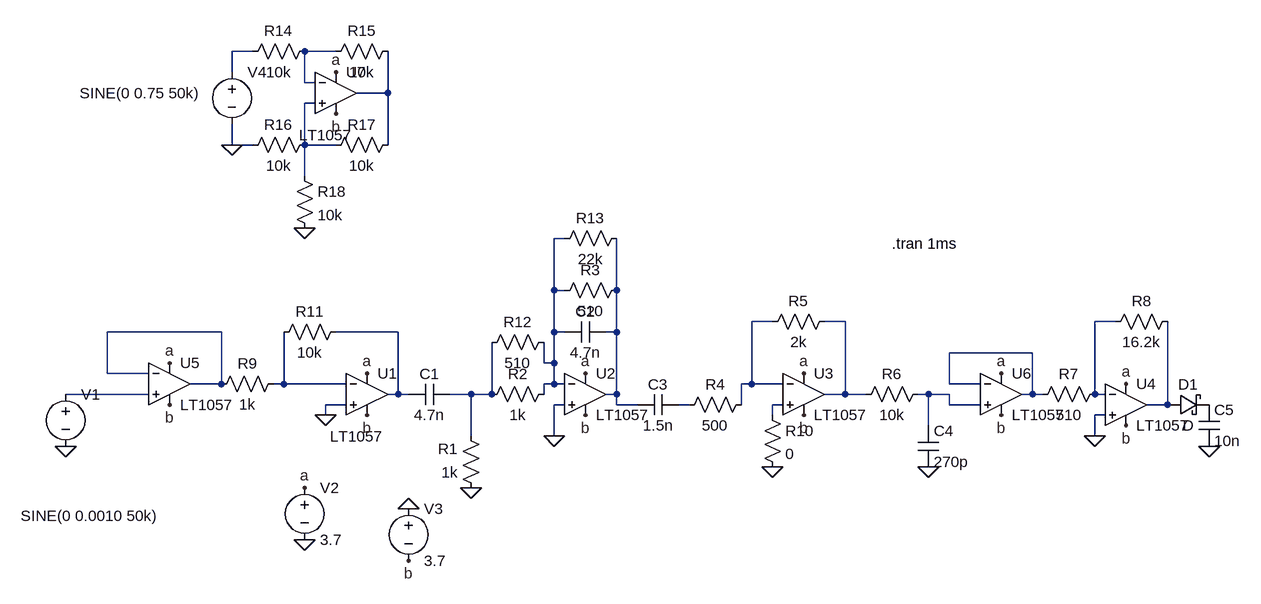
[diagram p0: schematic Filtrado actual.asc]
Filtrado actual.asc, the LTspice schematic file:
Version 4
SHEET 1 1228 680
WIRE -304 -208 -336 -208
WIRE -176 -208 -224 -208
WIRE -336 -176 -336 -208
WIRE -224 -160 -224 -208
WIRE -208 -160 -224 -160
WIRE -96 -144 -96 -208
WIRE -96 -144 -144 -144
WIRE -208 -128 -224 -128
WIRE -336 -64 -336 -96
WIRE -304 -64 -336 -64
WIRE -224 -64 -224 -128
WIRE -176 -64 -224 -64
WIRE -96 -64 -96 -144
WIRE -224 -16 -224 -64
WIRE 176 80 160 80
WIRE 160 160 160 80
WIRE 176 160 160 160
WIRE 256 160 256 80
WIRE 496 208 464 208
WIRE 608 208 576 208
WIRE 1024 208 992 208
WIRE -352 224 -528 224
WIRE -80 224 -176 224
WIRE 160 224 160 160
WIRE 176 224 160 224
WIRE 256 224 256 160
WIRE 256 224 240 224
WIRE 896 256 768 256
WIRE 144 272 144 240
WIRE 160 272 160 224
WIRE 160 272 144 272
WIRE -528 288 -528 224
WIRE -464 288 -528 288
WIRE -352 304 -352 224
WIRE -352 304 -400 304
WIRE -256 304 -256 224
WIRE -256 304 -272 304
WIRE -160 304 -256 304
WIRE 160 304 160 272
WIRE 160 304 144 304
WIRE 176 304 160 304
WIRE 464 304 464 208
WIRE 464 304 448 304
WIRE 512 304 464 304
WIRE 768 304 768 256
WIRE 816 304 768 304
WIRE -464 320 -592 320
WIRE -80 320 -80 224
WIRE -80 320 -96 320
WIRE -64 320 -80 320
WIRE 32 320 0 320
WIRE 64 320 64 240
WIRE 64 320 32 320
WIRE 144 320 144 304
WIRE 256 320 256 224
WIRE 256 320 240 320
WIRE 608 320 608 208
WIRE 608 320 576 320
WIRE 640 320 608 320
WIRE 736 320 720 320
WIRE 768 320 736 320
WIRE 896 320 896 256
WIRE 896 320 880 320
WIRE 912 320 896 320
WIRE 992 320 992 208
WIRE 1008 320 992 320
WIRE -160 336 -192 336
WIRE 176 336 160 336
WIRE 256 336 256 320
WIRE 288 336 256 336
WIRE 368 336 352 336
WIRE 448 336 448 304
WIRE 512 336 496 336
WIRE 768 336 768 320
WIRE 816 336 768 336
WIRE 1104 336 1104 208
WIRE 1104 336 1072 336
WIRE -192 352 -192 336
WIRE 496 352 496 336
WIRE 1008 352 992 352
WIRE 736 368 736 320
WIRE 32 384 32 320
WIRE 160 384 160 336
WIRE 992 384 992 352
FLAG 32 464 0
FLAG 992 384 0
FLAG 736 432 0
FLAG 160 384 0
FLAG -224 544 0
FLAG -64 496 0
FLAG -224 464 a
FLAG 208 288 a
FLAG -128 288 a
FLAG 544 288 a
FLAG 1040 304 a
FLAG -64 576 b
FLAG -128 352 b
FLAG 208 352 b
FLAG 544 352 b
FLAG 1040 368 b
FLAG -192 352 0
FLAG -432 272 a
FLAG -432 336 b
FLAG 848 288 a
FLAG 848 352 b
FLAG 496 432 0
FLAG 1168 400 0
FLAG -592 400 0
FLAG -224 64 0
FLAG -336 -64 0
FLAG -176 -176 a
FLAG -176 -112 b
SYMBOL Res 48 480 R180
WINDOW 0 36 76 Left 2
WINDOW 3 36 40 Left 2
SYMATTR InstName R1
SYMATTR Value 1k
SYMBOL Res 48 336 R270
WINDOW 0 32 56 VTop 2
WINDOW 3 0 56 VBottom 2
SYMATTR InstName R2
SYMATTR Value 1k
SYMBOL Res 160 176 R270
WINDOW 0 32 56 VTop 2
WINDOW 3 0 56 VBottom 2
SYMATTR InstName R3
SYMATTR Value 510
SYMBOL Res 352 352 R270
WINDOW 0 32 56 VTop 2
WINDOW 3 0 56 VBottom 2
SYMATTR InstName R4
SYMATTR Value 500
SYMBOL Res 480 224 R270
WINDOW 0 32 56 VTop 2
WINDOW 3 0 56 VBottom 2
SYMATTR InstName R5
SYMATTR Value 2k
SYMBOL Res 624 336 R270
WINDOW 0 32 56 VTop 2
WINDOW 3 0 56 VBottom 2
SYMATTR InstName R6
SYMATTR Value 10k
SYMBOL Res 896 336 R270
WINDOW 0 32 56 VTop 2
WINDOW 3 0 56 VBottom 2
SYMATTR InstName R7
SYMATTR Value 510
SYMBOL Res 1008 224 R270
WINDOW 0 32 56 VTop 2
WINDOW 3 0 56 VBottom 2
SYMATTR InstName R8
SYMATTR Value 16.2k
SYMBOL Cap -64 336 R270
WINDOW 0 32 32 VTop 2
WINDOW 3 0 32 VBottom 2
SYMATTR InstName C1
SYMATTR Value 4.7n
SYMBOL Cap 176 240 R270
WINDOW 0 32 32 VTop 2
WINDOW 3 0 32 VBottom 2
SYMATTR InstName C2
SYMATTR Value 4.7n
SYMBOL Cap 288 352 R270
WINDOW 0 32 32 VTop 2
WINDOW 3 0 32 VBottom 2
SYMATTR InstName C3
SYMATTR Value 1.5n
SYMBOL Cap 720 368 R0
SYMATTR InstName C4
SYMATTR Value 270p
SYMBOL Voltage -592 304 R0
WINDOW 3 -69 203 Left 2
SYMATTR Value SINE(0 0.0010 50k)
SYMATTR InstName V1
SYMBOL Voltage -224 448 R0
SYMATTR InstName V2
SYMATTR Value 3.7
SYMBOL Voltage -64 480 R0
SYMATTR InstName V3
SYMATTR Value 3.7
SYMBOL Res -256 288 R90
WINDOW 0 0 56 VBottom 2
WINDOW 3 32 56 VTop 2
SYMATTR InstName R9
SYMATTR Value 1k
SYMBOL OpAmps/LT1057 -128 256 R0
WINDOW 3 -57 129 Left 2
SYMATTR InstName U1
SYMBOL OpAmps/LT1057 208 256 R0
SYMATTR InstName U2
SYMBOL OpAmps/LT1057 544 256 R0
SYMATTR InstName U3
SYMBOL OpAmps/LT1057 1040 272 R0
SYMATTR InstName U4
SYMBOL OpAmps/LT1057 -432 240 R0
SYMATTR InstName U5
SYMBOL OpAmps/LT1057 848 256 R0
SYMATTR InstName U6
SYMBOL Res 480 336 R0
SYMATTR InstName R10
SYMATTR Value 0
SYMBOL schottky 1104 352 R270
WINDOW 0 32 32 VTop 2
WINDOW 3 0 32 VBottom 2
SYMATTR InstName D1
SYMBOL Cap 1152 336 R0
SYMATTR InstName C5
SYMATTR Value 10n
SYMBOL Res -160 208 R90
WINDOW 0 0 56 VBottom 2
WINDOW 3 32 56 VTop 2
SYMATTR InstName R11
SYMATTR Value 10k
SYMBOL Res 160 224 R90
WINDOW 0 0 56 VBottom 2
WINDOW 3 32 56 VTop 2
SYMATTR InstName R12
SYMATTR Value 510
SYMBOL Res 272 64 R90
WINDOW 0 0 56 VBottom 2
WINDOW 3 32 56 VTop 2
SYMATTR InstName R13
SYMATTR Value 22k
SYMBOL Res -208 -224 R90
WINDOW 0 0 56 VBottom 2
WINDOW 3 32 56 VTop 2
SYMATTR InstName R14
SYMATTR Value 10k
SYMBOL Res -80 -224 R90
WINDOW 0 0 56 VBottom 2
WINDOW 3 32 56 VTop 2
SYMATTR InstName R15
SYMATTR Value 10k
SYMBOL Res -208 -80 R90
WINDOW 0 0 56 VBottom 2
WINDOW 3 32 56 VTop 2
SYMATTR InstName R16
SYMATTR Value 10k
SYMBOL Res -80 -80 R90
WINDOW 0 0 56 VBottom 2
WINDOW 3 32 56 VTop 2
SYMATTR InstName R17
SYMATTR Value 10k
SYMBOL Res -240 -32 R0
SYMATTR InstName R18
SYMATTR Value 10k
SYMBOL Voltage -336 -192 R0
WINDOW 3 -234 48 Left 2
SYMATTR Value SINE(0 0.75 50k)
SYMATTR InstName V4
SYMBOL OpAmps/LT1057 -176 -208 R0
WINDOW 3 -57 129 Left 2
SYMATTR InstName U7
TEXT 680 88 Left 2 !.tran 1ms

The netlist it stands for:
* Filtrado actual.asc
R1 0 N015 1k
R2 N015 N005 1k
R3 N005 N006 510
R4 N017 N007 500
R5 N007 N008 2k
R6 N008 N016 10k
R7 N012 N009 510
R8 N009 N019 16.2k
C1 N011 N015 4.7n
C2 N005 N006 4.7n
C3 N006 N017 1.5n
C4 N016 0 270p
V1 N014 0 SINE(0 0.0010 50k)
V2 a 0 3.7
V3 0 b 3.7
R9 N013 N010 1k
XU1 0 N013 a b N011 LT1057  ; pins In+ In- V+ V- OUT
XU2 0 N005 a b N006 LT1057  ; pins In+ In- V+ V- OUT
XU3 N018 N007 a b N008 LT1057  ; pins In+ In- V+ V- OUT
XU4 0 N009 a b N019 LT1057  ; pins In+ In- V+ V- OUT
XU5 N014 N010 a b N010 LT1057  ; pins In+ In- V+ V- OUT
XU6 N016 N012 a b N012 LT1057  ; pins In+ In- V+ V- OUT
R10 N018 0 0
D1 N019 P001 D
C5 P001 0 10n
R11 N011 N013 10k
R12 N005 N015 510
R13 N006 N005 22k
R14 N002 N001 10k
R15 N003 N002 10k
R16 N004 0 10k
R17 N003 N004 10k
R18 N004 0 10k
V4 N001 0 SINE(0 0.75 50k)
XU7 N004 N002 a b N003 LT1057  ; pins In+ In- V+ V- OUT
.model D D
.lib standard.dio
.tran 1ms
.lib LTC.lib
.backanno
.end